# EAGLE schematic 220VAC-28VDC Converter (EAGLE 9.0.1)
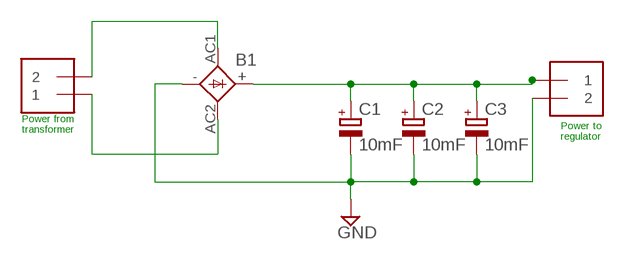
[diagram p0: schematic, sheet 1]

## Parts
B1  KBU  [KBU]
C1  10mF  CPOL-EUE10-35  [EB35D]
C2  10mF  CPOL-EUE10-35  [EB35D]
C3  10mF  CPOL-EUE10-35  [EB35D]
J1  1X2-3.5MM  [1X2-3.5MM]
J2  1X2-3.5MM  [1X2-3.5MM]

## Nets
GND: B1.- C1.- C2.- C3.- J2.2
N$1: B1.AC1 J1.2
N$2: B1.AC2 J1.1
N$4: B1.+ C1.+ C2.+ C3.+ J2.1

## Notes on the sheet
- Power from 
  transformer
- Power to 
  regulator

## Library data of the parts
B1 = rectifier:KBU: DIOTEC RECTIFIER
C1-C3 = rcl:CPOL-EU: POLARIZED CAPACITOR, European symbol; SPICEPREFIX: C
J1 J2 = adafruit:1X2: 3.5mm Terminal block http://www.ladyada.net/library/pcb/eaglelibrary.html